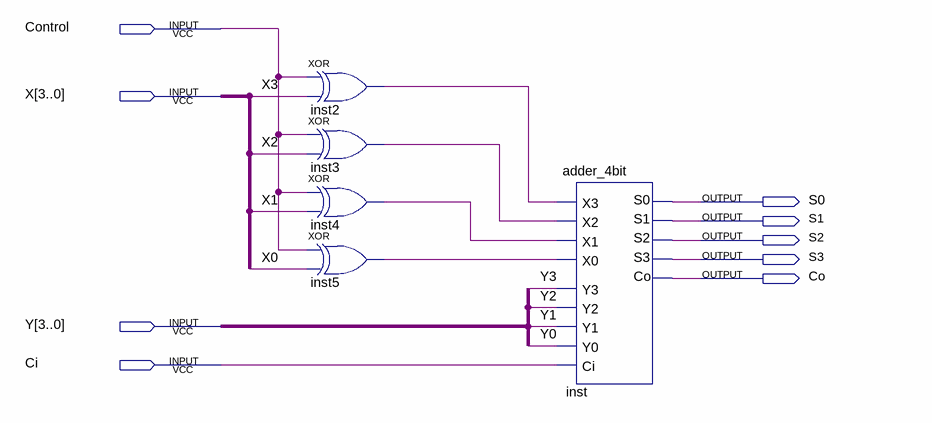
[diagram p0: schematic sheet]
// Quartus schematic AdderSub.bdf as structural Verilog: 5 symbols, 9 pins
module AdderSub (
  input  Control,
  input  [3:0] X,
  input  [3:0] Y,
  input  Ci,
  output S0,
  output S1,
  output S2,
  output S3,
  output Co
);

  wire inst2_out, inst3_out, inst4_out, inst5_out;

  xor inst2 (inst2_out, Control, X[3]);
  xor inst3 (inst3_out, Control, X[2]);
  xor inst4 (inst4_out, Control, X[1]);
  xor inst5 (inst5_out, Control, X[0]);
  adder_4bit inst (
    .X3(inst2_out), .Y3(Y[3]), .X2(inst3_out), .Y2(Y[2]), .X1(inst4_out), .Y1(Y[1]), .X0(inst5_out),
    .Y0(Y[0]), .Ci(Ci), .S0(S0), .S1(S1), .S2(S2), .S3(S3), .Co(Co));
endmodule
